# EAGLE design Solder Reflow Oven Shield (EAGLE 6.4)
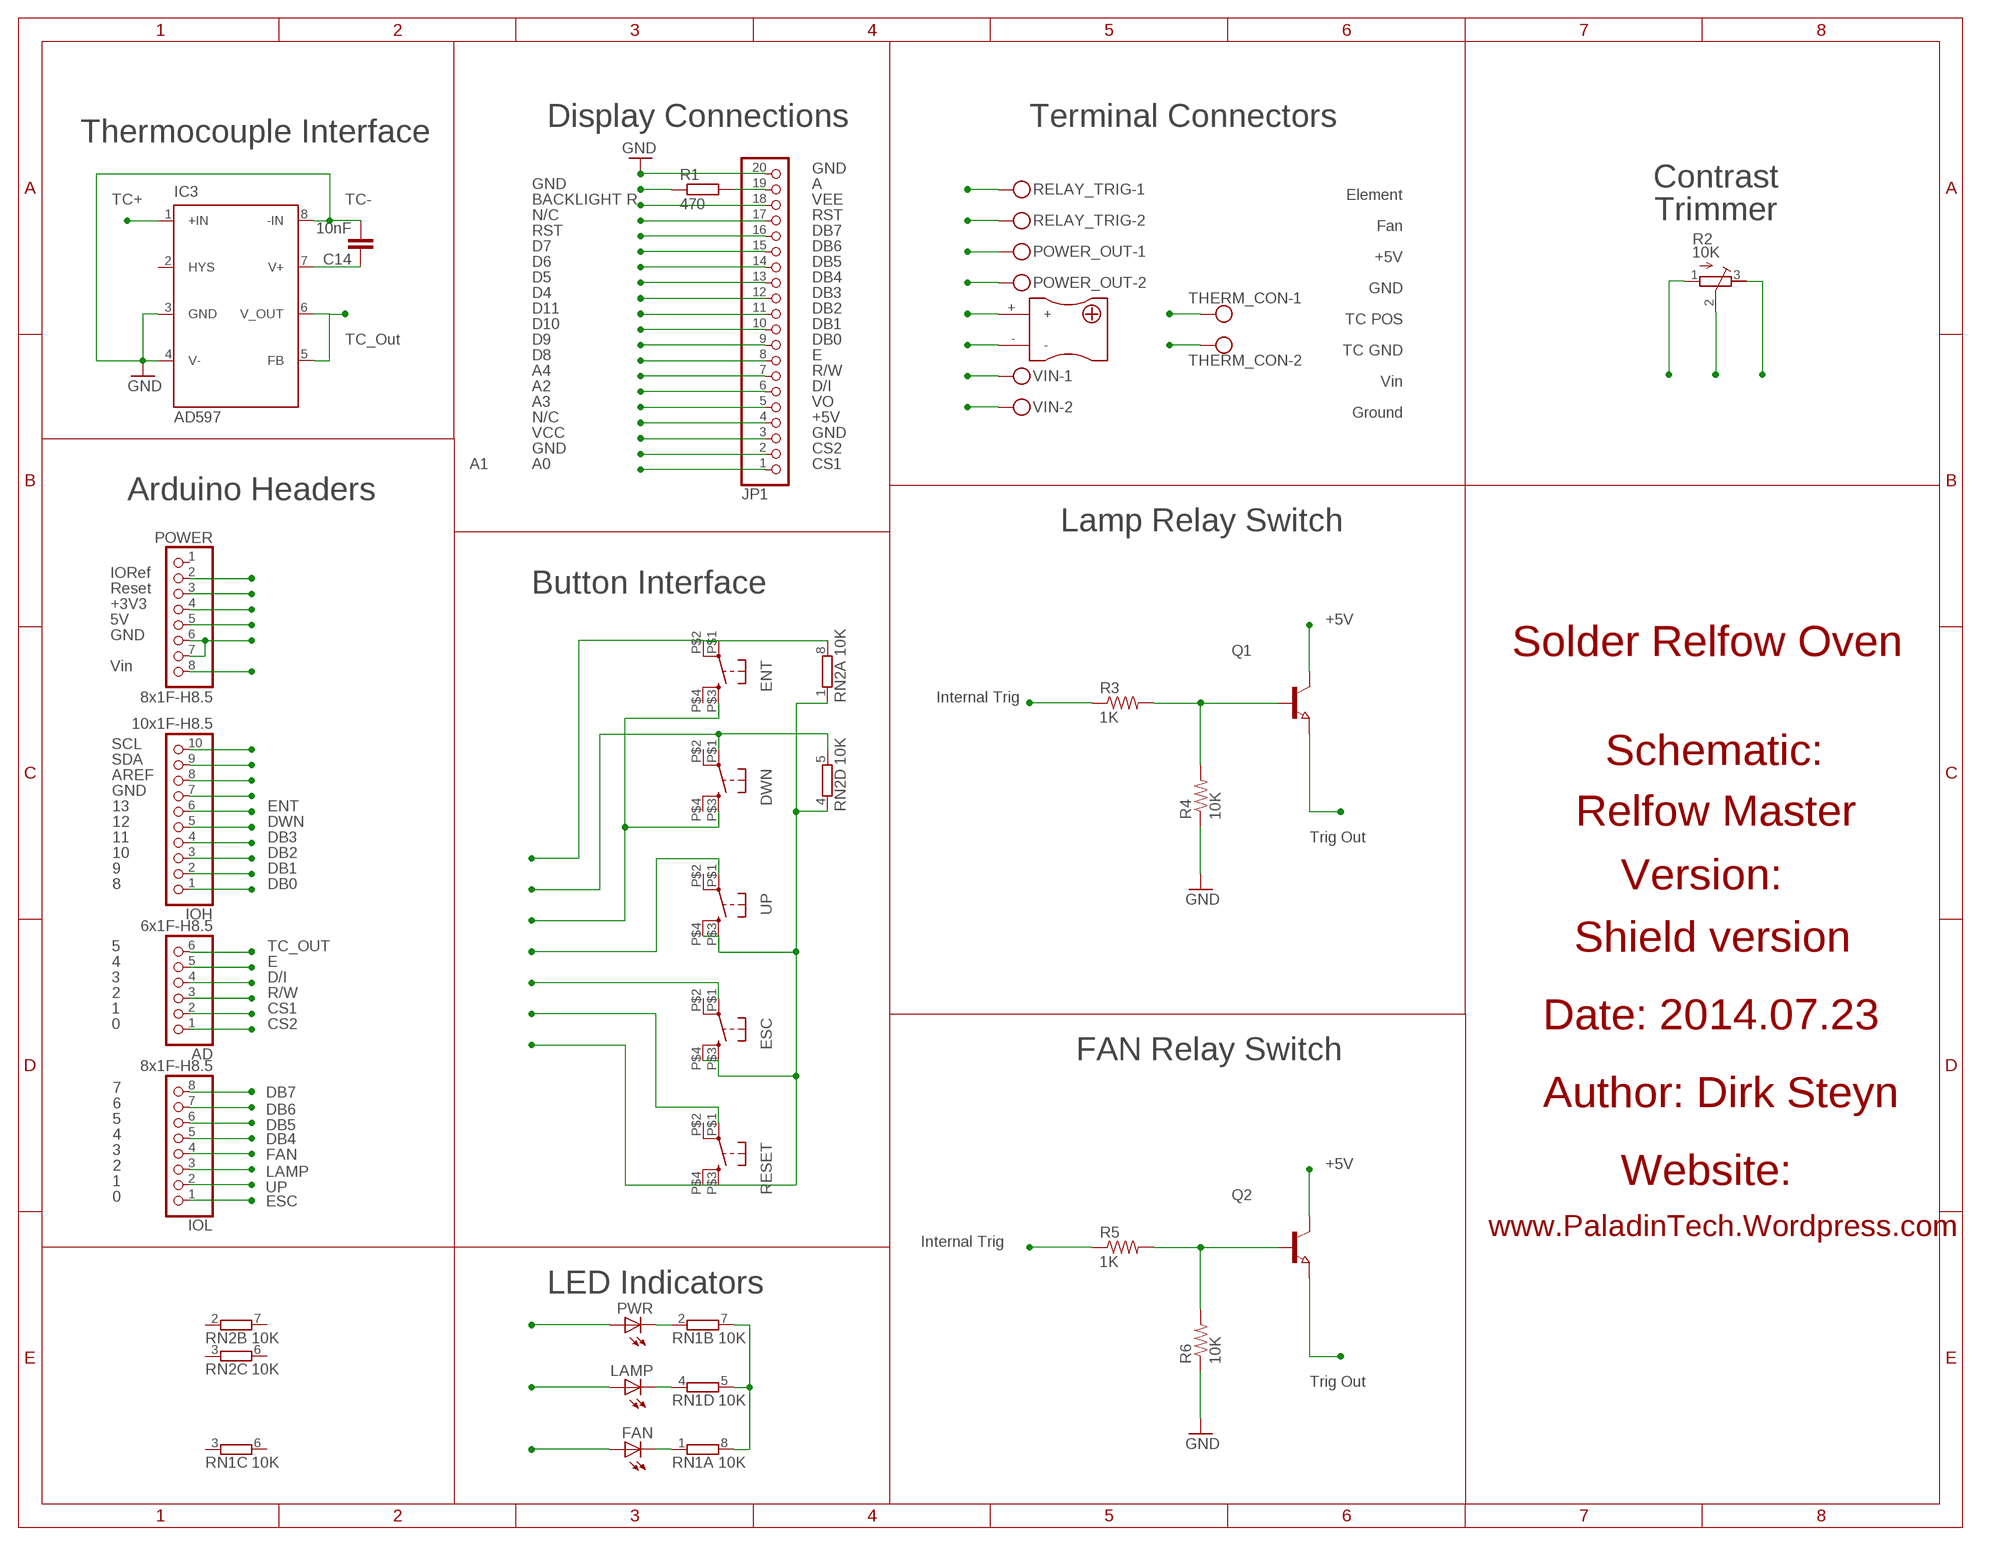
[diagram p0: schematic, sheet 1]

## Parts
AD  6x1F-H8.5  PINHD-1X6  [1X06]
C14  10nF  C-EUC0603  [C0603]
DWN  MANTECH_TAC  [MANTECH_TAC]
ENT  MANTECH_TAC  [MANTECH_TAC]
ESC  MANTECH_TAC  [MANTECH_TAC]
FAN  LEDCHIP-LED0603  [CHIP-LED0603]
IC3  AD597  [SO8]
IOH  10x1F-H8.5  PINHD-1X10_ARD  [1X10]
IOL  8x1F-H8.5  PINHD-1X8  [1X08]
JP1  PINHD-1X20  [1X20]
LAMP  LEDCHIP-LED0603  [CHIP-LED0603]
POWER  8x1F-H8.5  PINHD-1X8  [1X08]
POWER_OUT  MKDSN1,5/2-5,08  [2XPCB_TER]
PWR  LEDCHIP-LED0603  [CHIP-LED0603]
Q1  NPN-TRANSISTOR_SOT23  [SOT23]
Q2  NPN-TRANSISTOR_SOT23  [SOT23]
R1  470  R-EU_R0603  [R0603]
R2  10K  MURATA_PVZ3A  [MURATA_PVZ3A]
R3  1K  R-US_R0603  [R0603]
R4  10K  R-US_R0603  [R0603]
R5  1K  R-US_R0603  [R0603]
R6  10K  R-US_R0603  [R0603]
RELAY_TRIG  MKDSN1,5/2-5,08  [2XPCB_TER]
RESET  MANTECH_TAC  [MANTECH_TAC]
RN1  10K  4R-NEXB38V  [EXB38V]
RN2  10K  4R-NEXB38V  [EXB38V]
THERM_CON  MKDSN1,5/2-5,08  [2XPCB_TER]
U$1  THERMOCOUPLEPLUG_MINI  [TC-MINI]
UP  MANTECH_TAC  [MANTECH_TAC]
VIN  MKDSN1,5/2-5,08  [2XPCB_TER]

## Nets
+3V3: POWER.4
+5V: C14.1 DWN.P$3 ENT.P$3 IC3.7(V+) JP1.4 POWER.5 POWER_OUT.1 PWR.A Q1.3(C) Q2.3(C) R1.1
A: JP1.19 R1.2
AREF: IOH.8
CS1: AD.2 JP1.1
CS2: AD.1 JP1.2
D/I: AD.4 JP1.6
DB0: IOH.1 JP1.9
DB1: IOH.2 JP1.10
DB2: IOH.3 JP1.11
DB3: IOH.4 JP1.12
DB4: IOL.5 JP1.13
DB5: IOL.6 JP1.14
DB6: IOL.7 JP1.15
DB7: IOL.8 JP1.16
DWN: DWN.P$1 IOH.5 RN2.5
E: AD.5 JP1.8
ELEMENT_OUT: Q1.2(E) RELAY_TRIG.1
ENT: ENT.P$1 ENT.P$2 IOH.6 RN2.8
ESC: ESC.P$1 IOL.1
FAN: FAN.A IOL.4 R5.1
FAN_OUT: Q2.2(E) RELAY_TRIG.2
GND: C14.2 ESC.P$3 ESC.P$4 IC3.3(GND) IC3.4(V-) IC3.8(-IN) IOH.7 JP1.3 JP1.20 POWER.6 POWER.7 POWER_OUT.2 R2.3 R4.1 R6.1 RESET.P$3 RESET.P$4 RN1.5 RN1.7 RN1.8 RN2.1 RN2.4 THERM_CON.2 U$1.- UP.P$3 UP.P$4 VIN.2
IOREF: POWER.2
LAMP: IOL.3 LAMP.A R3.1
N$1: LAMP.C RN1.4
N$4: PWR.C RN1.2
N$5: FAN.C RN1.1
N$6: Q1.1(B) R3.2 R4.2
N$10: Q2.1(B) R5.2 R6.2
R/W: AD.3 JP1.7
RST: JP1.17 POWER.3 RESET.P$1
SCL: IOH.9
SDA: IOH.10
TC+: IC3.1(+IN) THERM_CON.1 U$1.+
TC_OUT: AD.6 IC3.5(FB) IC3.6(V_OUT)
UP: IOL.2 UP.P$1
VEE: JP1.18 R2.1
VIN: POWER.8 VIN.1
VO: JP1.5 R2.2
Unconnected: DWN.P$2 DWN.P$4 ENT.P$4 ESC.P$2 IC3.2(HYS) POWER.1 RESET.P$2 RN1.3 RN1.6 RN2.2 RN2.3 RN2.6 RN2.7 UP.P$2

## Notes on the sheet
- Display Connections | Terminal Connectors
- Thermocouple Interface
- GND
- GND | A | Element | Contrast
- TC+ | TC- | BACKLIGHT R | VEE
- N/C | RST | Fan | Trimmer
- RST | DB7
- D7 | DB6 | +5V
- D6 | DB5
- D5 | DB4 | GND
- D4 | DB3
- D11 | DB2 | TC POS
- D10 | DB1
- TC_Out | D9 | DB0 | TC GND
- D8 | E
- A4 | R/W | Vin
- A2 | D/I
- A3 | VO | Ground
- N/C | +5V
- VCC | GND
- GND | CS2
- A1 | A0 | CS1
- Arduino Headers
- Lamp Relay Switch
- IORef
- Reset | Button Interface
- +3V3
- 5V | +5V
- GND
- Solder Relfow Oven
- Vin
- Internal Trig
- SCL
- SDA | Schematic:
- AREF
- GND
- 13 | ENT
- 12 | DWN | Relfow Master
- 11 | DB3 | Trig Out
- 10 | DB2
- 9 | DB1
- 8 | DB0 | Version:
- 5 | TC_OUT | Shield version
- 4 | E
- 3 | D/I
- 2 | R/W
- 1 | CS1
- 0 | CS2 | Date: 2014.07.23
- FAN Relay Switch
- 7
- DB7
- 6 | Author: Dirk Steyn
- DB6
- 5
- DB5
- 4
- DB4
- 3
- FAN
- 2 | +5V
- LAMP
- 1 | Website:
- UP
- 0
- ESC
- www.PaladinTech.Wordpress.com
- Internal Trig
- LED Indicators
- Trig Out

## Library data of the parts
AD = SmartPrj:PINHD-1X6: PIN HEADER
C14 = rcl:C-EU: CAPACITOR, European symbol
DWN ENT ESC RESET UP = Test:MANTECH_TAC
FAN LAMP PWR = led:LED: LED OSRAM: - CHIPLED LG R971, LG N971, LY N971, LG Q971, LY Q971, LO R971, LY R971 LH N974, LH R974 LS Q976, LO Q976, LY Q976 LO Q996 - Hyper CHIPLED LW Q18S LB Q993, LB Q99A, LB R99A - SideLED LS A670, LO A670, LY A670, LG A670, LP A670 LB A673, LV A673, LT A673, LW A673 LH A674 LY A675 LS A676, LA A676, LO A676, LY A676, LW A676 LS A679, LY A679, LG A679 - Hyper Micro SIDELED® LS Y876, LA Y876, LO Y876, LY Y876 LT Y87S - SmartLED LW L88C, LW L88S LB L89C, LB L89S, LG L890 LS L89K, LO L89K, LY L89K LS L896, LA L896, LO L896, LY L896 - TOPLED LS T670, LO T670, LY T670, LG T670, LP T670 LSG T670, LSP T670, LSY T670, LOP T670, LYG T670 LG T671, LOG T671, LSG T671 LB T673, LV T673, LT T673, LW T673 LH T674 LS T676, LA T676, LO T676, LY T676, LB T676, LH T676, LSB T676, LW T676 LB T67C, LV T67C, LT T67C, LS T67K, LO T67K, LY T67K, LW E67C LS E67B, LA E67B, LO E67B, LY E67B, LB E67C, LV E67C, LT E67C LW T67C LS T679, LY T679, LG T679 LS T770, LO T770, LY T770, LG T770, LP T770 LB T773, LV T773, LT T773, LW T773 LH T774 LS E675, LA E675, LY E675, LS T675 LS T776, LA T776, LO T776, LY T776, LB T776 LHGB T686 LT T68C, LB T68C - Hyper Mini TOPLED® LB M676 - Mini TOPLED Santana® LG M470 LS M47K, LO M47K, LY M47K Source: http://www.osram.convergy.de LUXEON: - LUMILED® LXK2-PW12-R00, LXK2-PW12-S00, LXK2-PW14-U00, LXK2-PW14-V00 LXK2-PM12-R00, LXK2-PM12-S00, LXK2-PM14-U00 LXK2-PE12-Q00, LXK2-PE12-R00, LXK2-PE12-S00, LXK2-PE14-T00, LXK2-PE14-U00 LXK2-PB12-K00, LXK2-PB12-L00, LXK2-PB12-M00, LXK2-PB14-N00, LXK2-PB14-P00, LXK2-PB14-Q00 LXK2-PR12-L00, LXK2-PR12-M00, LXK2-PR14-Q00, LXK2-PR14-R00 LXK2-PD12-Q00, LXK2-PD12-R00, LXK2-PD12-S00 LXK2-PH12-R00, LXK2-PH12-S00 LXK2-PL12-P00, LXK2-PL12-Q00, LXK2-PL12-R00 Source: www.luxeon.com KINGBRIGHT: KA-3528ASYC Source: www.kingbright.com
IC3 = analog-devices:AD597
IOH = SmartPrj:PINHD-1X10_ARD: PIN HEADER
IOL POWER = SmartPrj:PINHD-1X8: PIN HEADER
JP1 = pinhead:PINHD-1X20: PIN HEADER
POWER_OUT RELAY_TRIG THERM_CON VIN = Test:MKDSN1,5/2-5,08: MKDSN 1,5/ 2-5,08 Printklemme Nennstrom: 13,5 A Nennspannung: 250 V Rastermaß: 5,08 mm Polzahl: 2 Anschlussart: Schraubanschluss Montage: Löten Anschlussrichtung Leiter/Platine: 0 ° Artikelnummer: 1729128 Source: http://eshop.phoenixcontact.com .. 1729128.pdf
Q1 Q2 = semicon-smd-ipc:NPN-TRANSISTOR_: NPN TRANSISTOR
R1 = rcl:R-EU_: RESISTOR, European symbol
R2 = Test:MURATA_PVZ3A
R3-R6 = rcl:R-US_: RESISTOR, American symbol
RN1 RN2 = resistor-dil:4R-N: Array Chip Resistor Source: RS Component / Phycomp; OC_FARNELL: unknown; OC_NEWARK: unknown
U$1 = max6675:THERMOCOUPLEPLUG_MINI

## Net classes
0 default: width 0.203 mm

## Board
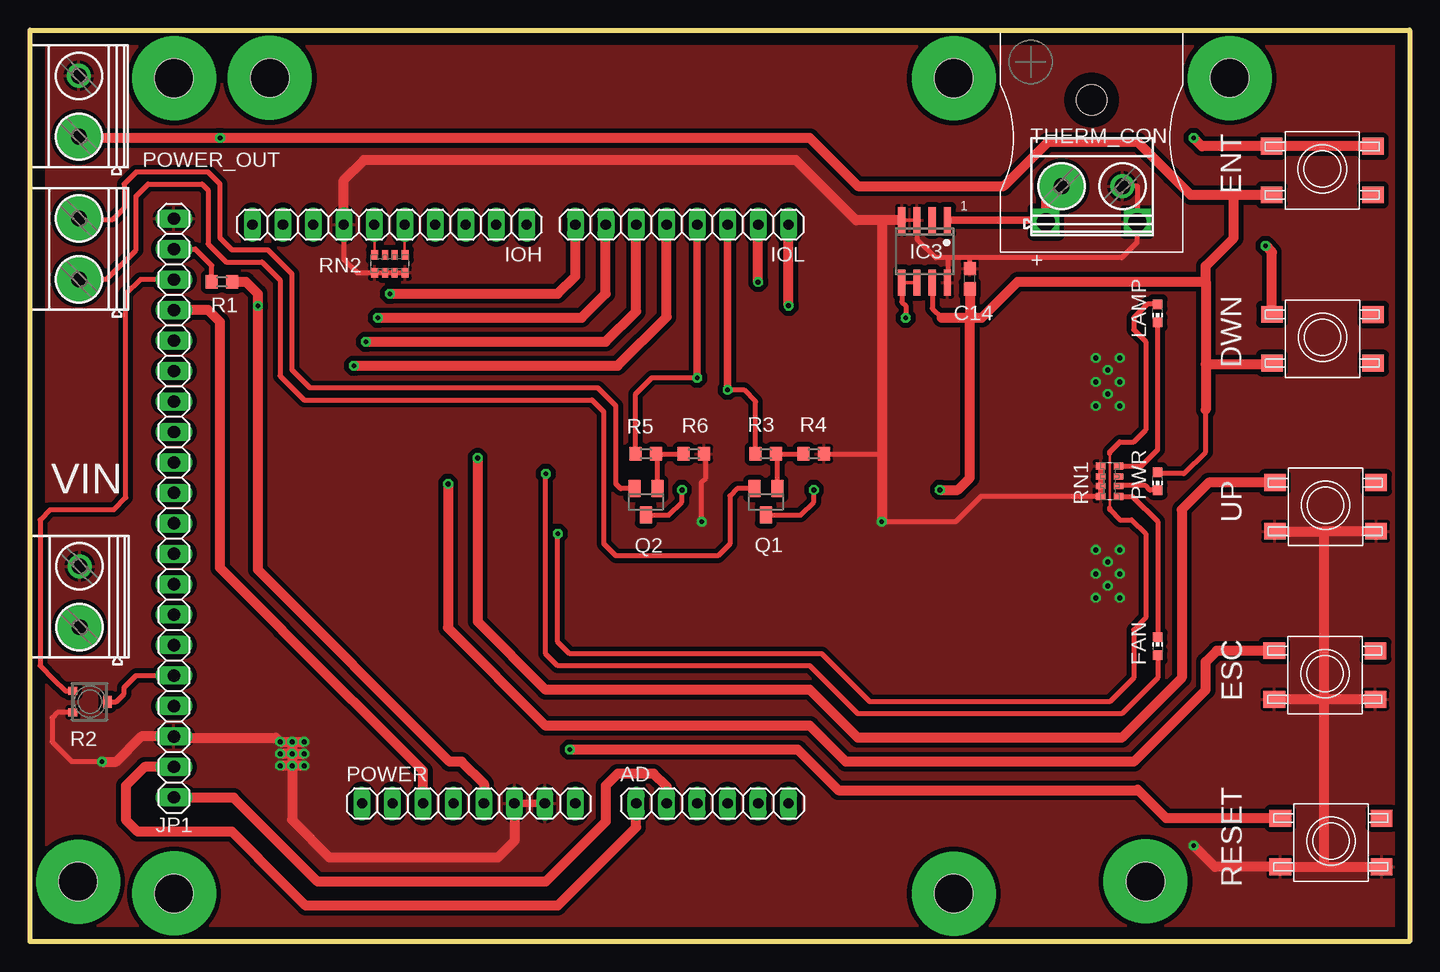
[diagram p1: board, top side]
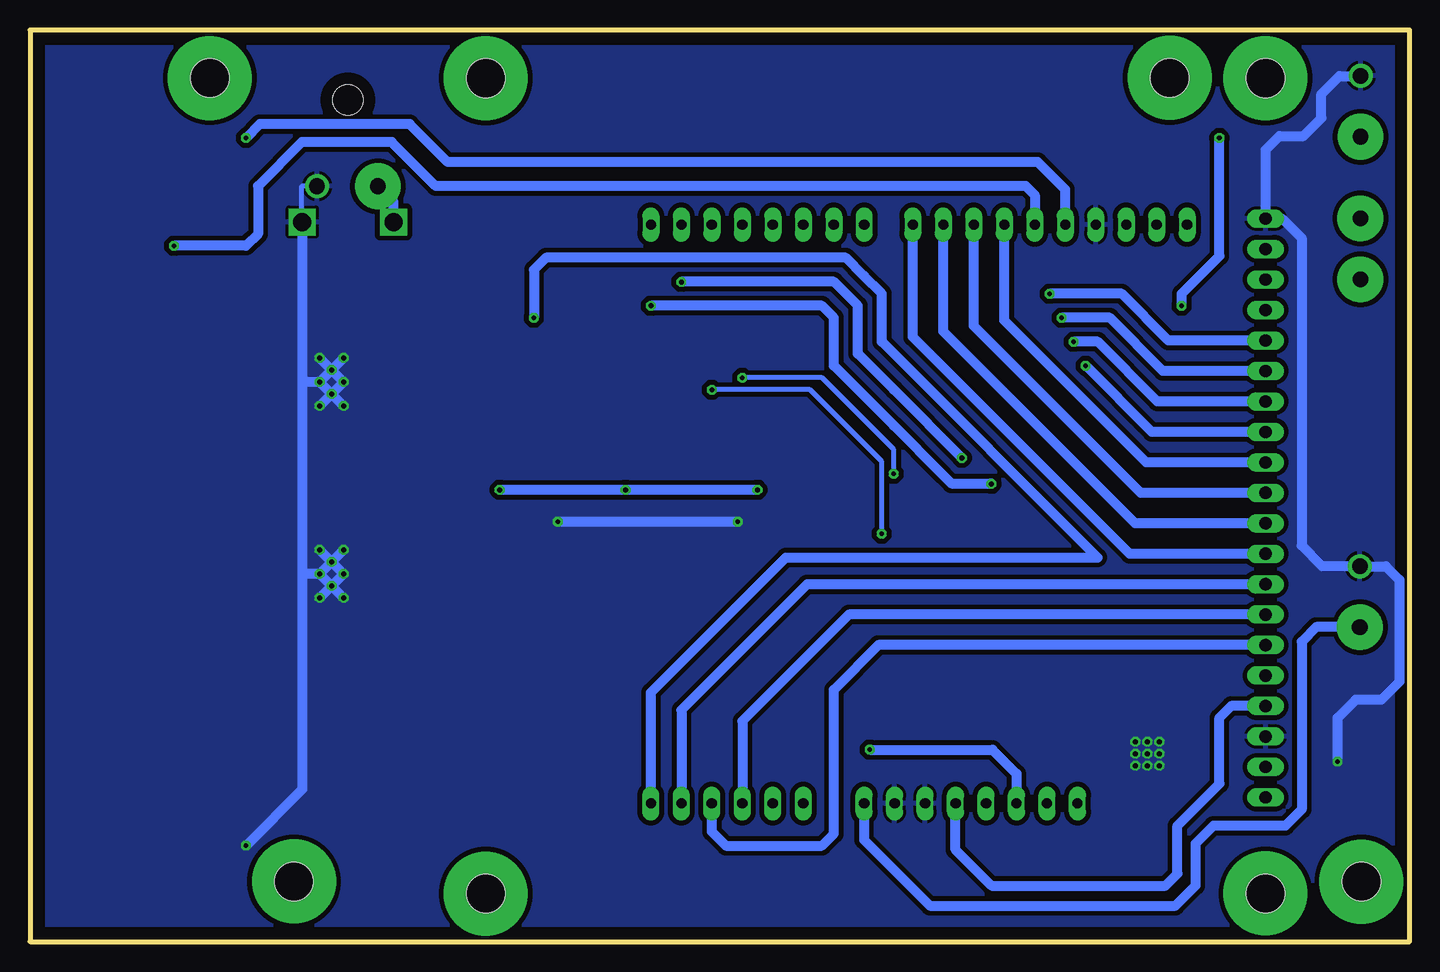
[diagram p2: board, bottom side, seen from below]

Size 115 x 76 mm. Coordinates in mm from the lower left corner, seen from the top.
Outline: 115,76 115,0 0,0 0,76 115,76
Copper layers (1*16): Top 0.035mm / dielectric 1.5mm / Bottom 0.035mm
Design rules "default": minimum track width 10mil, minimum drill 24mil, track to track 8mil, track to pad 8mil, pad to pad 8mil, via to via 8mil, smd to smd 8mil, copper to edge 40mil, drill to drill 8mil, minimum pad ring 10mil, minimum via ring 8mil, stop-mask expansion 4mil, vias tented up to drill 0mil, thermal gap 10mil
Holes 3.2 mm at 12.01,71.98 12,4 77.01,4 77.01,71.98 100,72 93,5 4,5 20,72

### Footprints (pad centres in the part's own frame; a part is rotated, then mirrored left to right if it is on the bottom)
1X06 = drill 0.85 pad 1.422 long: 1 -6.35,0; 2 -3.81,0; 3 -1.27,0; 4 1.27,0; 5 3.81,0; 6 6.35,0
C0603 = smd 1.1 x 1: 1 -0.85,0; 2 0.85,0
MANTECH_TAC = smd 1.4 x 1.8: P$1 -1.902,-4.215; P$2 -1.898,4.221; P$3 2.159,-4.215; P$4 2.155,4.222
CHIP-LED0603 = smd 0.8 x 0.8: A 0,-0.75; C 0,0.75
SO8 = smd 0.6 x 2.2: 1 -1.905,-2.6; 2 -0.635,-2.6; 3 0.635,-2.6; 4 1.905,-2.6; 5 1.905,2.6; 6 0.635,2.6; 7 -0.635,2.6; 8 -1.905,2.6
1X10 = drill 0.85 pad 1.422 long: 1 -11.43,0; 2 -8.89,0; 3 -6.35,0; 4 -3.81,0; 5 -1.27,0; 6 1.27,0; 7 3.81,0; 8 6.35,0; 9 8.89,0; 10 11.43,0
1X08 = drill 0.85 pad 1.422 long: 1 -8.89,0; 2 -6.35,0; 3 -3.81,0; 4 -1.27,0; 5 1.27,0; 6 3.81,0; 7 6.35,0; 8 8.89,0
1X20 = drill 1.016 long: 1 -24.13,0; 2 -21.59,0; 3 -19.05,0; 4 -16.51,0; 5 -13.97,0; 6 -11.43,0; 7 -8.89,0; 8 -6.35,0; 9 -3.81,0; 10 -1.27,0; 11 1.27,0; 12 3.81,0; 13 6.35,0; 14 8.89,0; 15 11.43,0; 16 13.97,0; 17 16.51,0; 18 19.05,0; 19 21.59,0; 20 24.13,0
2XPCB_TER = drill 1.3 pad 2: 1 -2.561,0.025; 2 2.519,0.025
SOT23 = smd 1 x 1.4: 1 -0.95,-1.1; 2 0.95,-1.1; 3 0,1.1
R0603 = smd 1 x 1.1: 1 -0.85,0; 2 0.85,0
MURATA_PVZ3A = smd 0.7 x 0.75: 1 -0.9,-1.424; 3 0.899,-1.425 | smd 1 x 0.7: 2 0,1.449
EXB38V = smd 0.6 x 0.8: 1 -1.275,-0.75; 4 1.275,-0.75; 5 1.275,0.75; 8 -1.275,0.75 | smd 0.5 x 0.8: 2 -0.4,-0.75; 3 0.4,-0.75; 6 0.4,0.75; 7 -0.4,0.75
TC-MINI = drill 1.5 square: + -3.81,0; - 3.81,0 | hole 2.5: 0,10.16

### Placement (x,y rotation side)
AD  56.89,11.51 0 top
C14  78.34,55.26 90 top
DWN  107.75,50.38 270 top
ENT  107.73,64.4 270 top
ESC  107.94,22.34 270 top
FAN  94,24.62 0 top
IC3  74.58,57.54 180 top
IOH  29.97,59.77 180 top
IOL  54.35,59.77 180 top
JP1  12,36.14 90 top
LAMP  94,52.38 180 top
POWER  36.57,11.51 0 top
POWER_OUT  4.1,69.66 90 top
PWR  94,38.38 180 top
Q1  61.34,36.66 180 top
Q2  51.34,36.66 180 top
R1  16,55 180 top
R2  5,20 270 top
R3  61.34,40.66 0 top
R4  65.34,40.66 180 top
R5  51.34,40.66 0 top
R6  55.34,40.66 180 top
RELAY_TRIG  4.12,57.77 90 top
RESET  108.45,8.38 270 top
RN1  90,38.38 90 top
RN2  30,56.5 0 top
THERM_CON  88.56,62.95 0 top
U$1  88.5,60 0 top
UP  108,36.36 270 top
VIN  4.17,28.77 90 top

### Tracks (layer width: path | path; a pad name or v marks a point on that pad's centre or on a via)
+5V  (via drill 0.41, 1.3 pad 3.81)
  Top 0.203: PWR.A 94.13,39
  Top 0.406: 94.13,39 96.18,39 98,40.81 98,44.31 | IC3.7 75.21,52.78 76,52 | Q2.3 53.24,35.56 54.34,36.66 v54.34,37.66 | Q1.3 64.24,35.56 65.34,36.66 v65.34,37.66 | POWER_OUT.1 | POWER_OUT.1
  Top 0.61: 103,48.11 DWN.P$3
  Top 0.813: R1.1 18,55 19,54 v19,53 19,31 35,15 36,15 37.84,13.16 POWER.5 | 76,52 78.34,52 | 78.34,52 79.34,52 82.34,55 98,55 | C14.1 78.34,52 | v75.84,37.66 77.34,37.66 78.34,38.66 78.34,52 | POWER_OUT.1 4.18,67 v15.84,67 65,67 69,63 81.18,63 84.84,66.66 92.34,66.66 95.15,63.85 96.76,62.24 100.34,62.24 | ENT.P$3 100.34,62.24 | 100.34,62.24 100.34,58.66 98,56.31 98,55 | 103,48.11 98,48.11 | 98,48.11 98,44.31 | 98,55 98,48.11
  Bottom 0.813: JP1.4 14.87,19.63 15.84,18.66 15.84,13.16 19.34,9.66 19.34,5.66 20.34,4.66 34.84,4.66 37.84,7.66 POWER.5 | v54.34,37.66 v65.34,37.66 v75.84,37.66 | v19,53 19,54 15.84,57.16 v15.84,67
  other vias: 4.08,67.1
A
  Top 0.406: R1.2 15.15,56.35 13.77,57.73 JP1.19
CS1
  Top 0.813: JP1.1 17,12 24,5 43,5 48,10 48,13 49,14 52,14 53.08,12.92 AD.2
CS2
  Top 0.813: JP1.2 9.55,14.55 8,13 8,10.16 9,9.16 16.84,9.16 19,7 23,3 44,3 50.54,9.54 AD.1
D/I
  Bottom 0.813: JP1.6 44.29,24.71 48,21 48,9 49,8 57,8 58.16,9.16 AD.4
DB0
  Bottom 0.813: JP1.9 23.33,32.33 41.4,50.4 IOH.1
DB1
  Bottom 0.813: JP1.10 22.87,34.87 38.86,50.86 IOH.2
DB2
  Bottom 0.813: JP1.11 22.41,37.41 36.32,51.32 IOH.3
DB3
  Bottom 0.813: JP1.12 21.95,39.95 33.78,51.78 IOH.4
DB4  (via drill 0.41)
  Top 0.813: v27,48 49,48 53.08,52.08 IOL.5
  Bottom 0.813: JP1.13 21.49,42.49 v27,48
DB5  (via drill 0.41)
  Top 0.813: v28,50 48,50 50.54,52.54 IOL.6
  Bottom 0.813: JP1.14 21.03,45.03 26,50 v28,50
DB6  (via drill 0.41)
  Top 0.813: v29,52 46,52 48,54 IOL.7
  Bottom 0.813: JP1.15 20.57,47.57 25,52 v29,52
DB7  (via drill 0.41)
  Top 0.813: v30,54 44,54 45.46,55.46 IOL.8
  Bottom 0.813: JP1.16 20.11,50.11 24,54 v30,54
DWN  (via drill 0.41)
  Top 0.203: 31.24,57.29 IOH.5
  Top 0.406: 31.24,57.29 RN2.5
  Top 0.813: v103,58 103.53,57.47 DWN.P$1
  Bottom 0.813: v103,58 97,58 96,59 96,63 92.34,66.66 84.84,66.66 81.18,63 32,63 31.24,62.24 IOH.5
E
  Bottom 0.813: JP1.8 50.21,29.79 60.7,19.3 AD.5
ELEMENT_OUT  (via drill 1.3 pad 3.81)
  Top 0.254: RELAY_TRIG.1
  Top 0.406: Q1.2 58.94,37.76 58.34,37.16 58.34,33.16 57.34,32.16 48.84,32.16 47.84,33.16 47.84,44.16 46.84,45.16 22.84,45.16 20.84,47.16 20.84,55.16 19.34,56.66 16.34,56.66 14.84,58.16 14.84,62.66 14.34,63.16 9.84,63.16 8.84,62.16 8.84,57.66 6.39,55.21 RELAY_TRIG.1
  other vias: 4.1,55.21
ENT  (via drill 0.41)
  Top 0.203: RN2.8 28.72,59.74 IOH.6
  Top 0.61: 112.47,66.66 ENT.P$2
  Top 0.813: v97,67 97.7,66.3 ENT.P$1 ENT.P$2
  Bottom 0.813: IOH.6 28.72,59.8 28.72,62.72 31,65 80.18,65 83.34,68.16 95.84,68.16 v97,67
ESC  (via drill 0.41)
  Top 0.813: v63.24,53.01 IOL.1 | v34.84,38.16 34.84,26.15 43,18 65,18 68,15 92,15 98,21 98,23.31 98.93,24.24 ESC.P$1
  Bottom 0.813: v63.24,53.01 63.23,53 49,53 48,52 48,48 43,43 39,39 38.88,38.88 38.21,38.21 34.89,38.21 v34.84,38.16
FAN  (via drill 0.41)
  Top 0.406: FAN.A 94,22 91,19 69,19 65,23 44,23 43,24 v43,39 | R5.1 50.49,45.65 51.84,47 v55.62,47
  Top 0.61: IOL.4 v55.62,47
  Bottom 0.406: v43,39 43,41 49,47 v55.62,47
FAN_OUT  (via drill 1.3 pad 3.81)
  Top 0.254: RELAY_TRIG.2 | RELAY_TRIG.2
  Top 0.406: Q2.2 49.24,37.76 48.84,38.16 48.84,44.66 47.34,46.16 23.34,46.16 21.84,47.66 21.84,55.66 19.84,57.66 16.84,57.66 15.84,58.66 15.84,63.16 14.84,64.16 8.84,64.16 7.84,63.16 7.84,61.16 6.84,60.16 4.23,60.16 RELAY_TRIG.2
  other vias: 4.1,60.29
GND  (via drill 0.41)
  Top 0.305: IC3.3 IC3.4
  Top 0.406: IC3.3 73.94,58.56 75.5,57 76.54,57 | IC3.8 76.54,55 76.54,57 | R2.3 2.29,19.1 1.84,18.66 1.84,16.66 3.5,15 v6,15 | RN1.5 RN1.7 89.23,38 89.23,37.12 RN1.8 79.29,37.1 77.18,35 v71,35 | 78.34,57 91,57 92.31,58.31 U$1.- 92.34,60 92.34,62.97 THERM_CON.2 | 78.34,57 76.54,57 | C14.2 78.34,57 | v56,35 56,38.31 56.34,38.66 56.34,40.51 R6.1 | IOH.7 26.16,56.85 27.25,55.75 RN2.4 | R4.1 71,40.66
  Top 0.61: POWER.6 POWER.7
  Top 0.813: POWER.6 40.38,8.38 39,7 25,7 21.84,10.15 v21.84,14.66 | v6,15 7.18,15 9.27,17.09 JP1.3 | v97,8 98.79,6.22 RESET.P$3 107.84,6.22 | 12.09,17 20.5,17 v20.84,16.66 v21.84,16.66 | v21.84,16.66 v22.84,16.66 | v21.84,16.66 v21.84,15.66 | v21.84,15.66 v20.84,15.66 | v21.84,15.66 v22.84,15.66 | v21.84,15.66 v21.84,14.66 | v21.84,14.66 v20.84,14.66 | v22.84,14.66 v21.84,14.66 | v71,35 71,40.66 71,59.98 70.84,60.14 | IC3.4 70.84,60.14 | 70.84,60.14 68.86,60.14 63.84,65.16 27.84,65.16 26.16,63.47 IOH.7 | 107.84,6.22 RESET.P$4 | ESC.P$4 107.84,20.18 | 107.84,20.18 ESC.P$3 | UP.P$4 107.84,34.21 | 107.84,20.18 107.84,34.2 UP.P$3 107.84,34.21 | 107.84,34.21 107.84,6.22
  Bottom 0.406: U$1.- 92.34,60 92.34,62.97 THERM_CON.2
  Bottom 0.813: U$1.- 92.31,46.66 | 92.31,46.66 92.31,30.66 | 92.31,30.66 92.31,12.69 v97,8 | v6,15 6,18.66 4.5,20.16 2.34,20.16 0.84,21.66 0.84,30.16 1.97,31.29 VIN.2 7.29,31.29 9,33 9,58.66 10.61,60.27 JP1.20 12,66 10.84,67.16 8.84,67.16 7.34,68.66 7.34,70.66 5.84,72.16 4.1,72.16 POWER_OUT.2 | v88.84,32.66 v89.84,31.66 | v89.84,31.66 v90.84,30.66 | v90.84,32.66 v89.84,31.66 | v89.84,31.66 v88.84,30.66 v89.84,29.66 | v89.84,29.66 v90.84,28.66 | v89.84,29.66 v90.84,30.66 | v90.84,30.66 92.31,30.66 | v89.84,29.66 v88.84,28.66 | v88.84,48.66 v89.84,47.66 | v89.84,47.66 v90.84,48.66 | v89.84,47.66 v88.84,46.66 v89.84,45.66 v90.84,44.66 | v90.84,46.66 92.31,46.66 | v90.84,46.66 v89.84,47.66 | v88.84,44.66 v90.84,46.66 | v71,35 v56,35
  pour Top (isolate 0.406): 0.01,0.98 115,1 115,76 -0.01,76
  pour Bottom (isolate 0.406): 0.01,0.01 115,0 115,76 -0.01,76
LAMP  (via drill 0.41)
  Top 0.203: 90,36.16 90,40.66
  Top 0.406: LAMP.A 93.13,53.13 92,52 92,51 93,50 93,42.66 92,41.66 90.84,41.66 90,40.81 90,40.66 | v44,34 44,25 45,24 66,24 70,20 90,20 92,22 92,26 93,27 93,34 91.84,35.15 91.84,35.16 90.84,35.16 90,36 90,36.16 | v58.15,45.99 v58.16,46 59.5,46 60.49,45.01 R3.1
  Top 0.61: IOL.3 v58.16,46
  Bottom 0.406: v44,34 44,40 50,46 v58.16,46
N$1
  Top 0.406: RN1.4 92.65,39.65 94,41 LAMP.C
N$3  (via drill 3.2 pad 7)
  other vias: 12,4
N$4
  Top 0.406: PWR.C 93.37,37.63 93,38 90.77,38 RN1.2
N$5
  Top 0.406: RN1.1 91.89,37.1 94,35 FAN.C
N$6
  Top 0.406: R4.2 R3.2 62.29,40.56 Q1.1
N$8  (via drill 3.2 pad 7)
  other vias: 4,5
N$9  (via drill 3.2 pad 7)
  other vias: 77.01,4
N$10
  Top 0.406: R6.2 R5.2 52.29,40.56 Q2.1
N$11  (via drill 3.2 pad 7)
  other vias: 93,5
N$12  (via drill 3.2 pad 7)
  other vias: 77.01,71.98
N$13  (via drill 3.2 pad 7)
  other vias: 100,72
N$14  (via drill 3.2 pad 7)
  other vias: 12.01,71.98
N$15  (via drill 3.2 pad 7)
  other vias: 20,72
R/W
  Bottom 0.813: JP1.7 46.75,27.25 55.62,18.38 AD.3
RST  (via drill 0.41)
  Top 0.813: POWER.3 32.76,14.24 21,26 15.84,31.16 15.84,51.66 14.84,52.66 JP1.17 | v45,16 64,16 67.39,12.61 92.29,12.61 92.34,12.66 94.34,10.66 94.39,10.61 94.73,10.28 RESET.P$1
  Bottom 0.813: v45,16 34.76,16 32.76,14 POWER.3
TC+  (via drill 1.3 pad 3.81)
  Top 0.406: v86,62.97 | v86,62.97
  Top 0.61: IC3.1 84.55,60.14 U$1.+
  Top 0.813: v86,62.97 v85.99,62.97 84.69,61.67 U$1.+
  Bottom 0.813: U$1.+ 84.69,61.67 v86,62.97
TC_OUT  (via drill 0.41)
  Top 0.305: IC3.5 IC3.6
  Top 0.406: IC3.5 72.67,53.32 73,53 v73,52
  Bottom 0.813: AD.6 63.24,20.76 52,32 26,32 44,50 44,54.01 45.47,55.48 45.48,55.48 47,57 72,57 73,56 v73,52
UP  (via drill 0.41)
  Top 0.813: v60.7,54.99 IOL.2 | v37.32,40.32 37.32,26.68 43,21 65,21 69,17 91,17 96,22 96,36 98.26,38.26 UP.P$1
  Bottom 0.813: v60.7,54.99 60.69,55 48,55 46,53 46,49 43,46 v37.32,40.32
VEE
  Top 0.406: JP1.18 9.19,55.19 8,54 8,37 7,36 1.68,36 0.84,35.16 0.84,22.98 1.99,21.83 | 1.99,21.83 2.92,20.9 R2.1 | 2,21.83 1.99,21.83
VIN  (via drill 1.3 pad 3.81)
  Bottom 0.254: VIN.1
  Bottom 0.813: POWER.8 45.46,8.46 40,3 19.5,3 17.84,4.66 17.84,8.16 16.34,9.66 10.34,9.66 9,11 9,25 7.79,26.21 VIN.1
  other vias: 4.14,26.21
VO
  Top 0.406: R2.2 7.18,20 7.84,20.66 7.84,21.17 8.84,22.17 JP1.5

### Text on the board
tNames: 1
121bmp: GND | TC | PALADIN ENABLING | +5V | TECHNOLOGIES | FAN | TC+ | TC- | LAMP | Relay | Trig | V- | GND | Vin | V+ | www.paladintech.wordpress.com | Reflow Master Shield
122bmp: GND | www.heathersteyn.com | +5V | South Africa | C:/Users/Dirk Steyn/Dropbox/Solder Reflow Oven/Reflow Master/tablemountain.bmp | Designed in Cape Town